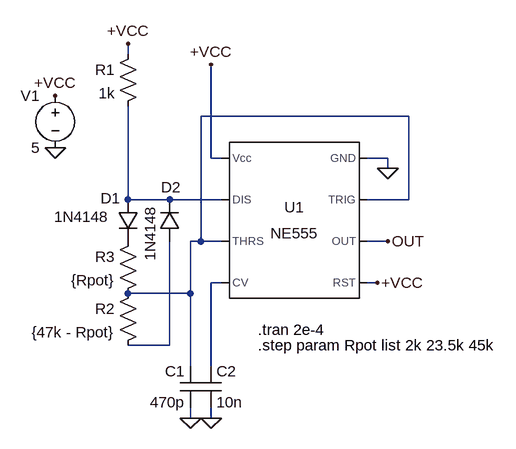
[diagram p0: schematic lista7_zad5.asc]
lista7_zad5.asc, the LTspice schematic file:
Version 4.1
SHEET 1 1544 752
WIRE 80 -144 80 -160
WIRE 512 -48 192 -48
WIRE 208 16 208 -128
WIRE 224 16 208 16
WIRE 480 16 448 16
WIRE 480 32 480 16
WIRE 80 80 80 -64
WIRE 144 80 80 80
WIRE 224 80 144 80
WIRE 512 80 512 -48
WIRE 512 80 448 80
WIRE 192 144 192 -48
WIRE 192 144 176 144
WIRE 224 144 192 144
WIRE 480 144 448 144
WIRE 224 208 208 208
WIRE 464 208 448 208
WIRE 176 224 176 144
WIRE 176 224 80 224
WIRE 144 304 144 144
WIRE 144 304 80 304
WIRE 176 336 176 224
WIRE 208 336 208 208
WIRE 176 416 176 400
WIRE 208 416 208 400
FLAG -32 0 0
FLAG -32 -80 +VCC
FLAG 176 416 0
FLAG 208 416 0
FLAG 208 -128 +VCC
FLAG 464 208 +VCC
FLAG 80 -160 +VCC
FLAG 480 32 0
FLAG 480 144 OUT
SYMBOL Misc\\NE555 336 112 M0
SYMATTR InstName U1
SYMBOL voltage -32 -96 M0
WINDOW 123 0 0 Left 0
WINDOW 39 0 0 Left 0
SYMATTR InstName V1
SYMATTR Value 5
SYMBOL cap 192 336 M0
SYMATTR InstName C1
SYMATTR Value 470p
SYMBOL cap 192 336 R0
SYMATTR InstName C2
SYMATTR Value 10n
SYMBOL res 96 208 M0
SYMATTR InstName R2
SYMATTR Value {47k - Rpot}
SYMBOL res 96 -160 M0
SYMATTR InstName R1
SYMATTR Value 1k
SYMBOL res 96 128 M0
SYMATTR InstName R3
SYMATTR Value {Rpot}
SYMBOL diode 128 144 M180
WINDOW 0 3 83 Left 2
WINDOW 3 -14 55 VLeft 2
SYMATTR InstName D2
SYMATTR Value 1N4148
SYMBOL diode 64 80 R0
WINDOW 0 -26 -2 Left 2
WINDOW 3 -98 26 Left 2
SYMATTR InstName D1
SYMATTR Value 1N4148
TEXT 280 280 Left 2 !.tran 2e-4
TEXT 280 304 Left 2 !.step param Rpot list 2k 23.5k 45k

The netlist it stands for:
* lista7_zad5.asc
X§U1 0 N001 OUT +VCC N003 N001 N002 +VCC NE555  ; pins GND TRIG OUT RST CV THRS DIS Vcc
V1 +VCC 0 5
C1 N001 0 470p
C2 N003 0 10n
R2 N001 N004 {47k - Rpot}
R1 +VCC N002 1k
R3 P001 N001 {Rpot}
D2 N004 N002 1N4148
D1 N002 P001 1N4148
.model D D
.lib standard.dio
.tran 2e-4
.step param Rpot list 2k 23.5k 45k
.lib NE555.sub
.backanno
.end